# Altium schematic sheet USB_A & USB_C.SchDoc
size A3; DocumentNumber: 8; SheetNumber: 8; SheetTotal: 12
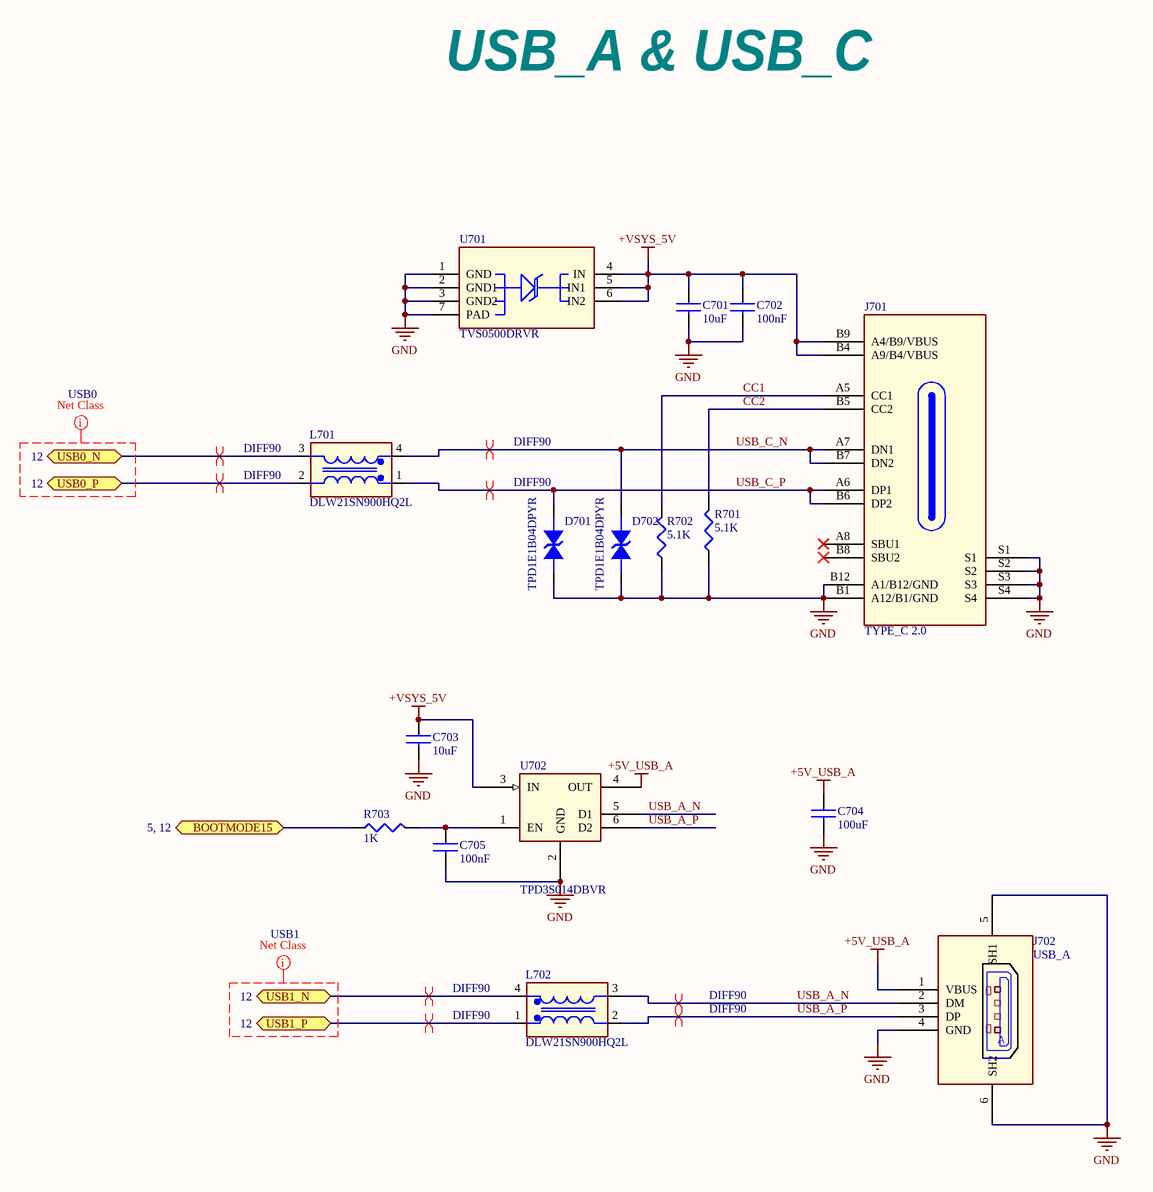
[diagram p0: USB_A & USB_C.SchDoc]

## Parts
C701  10uF  [C0603]
C702  100nF  [C0201]
C703  10uF  [C0603]
C704  100uF  [C1206B/3216MM]
C705  100nF  [C0201]
D701  TPD1E1B04DPYR  [DIO_TPD1E05U06DPYR]
D702  TPD1E1B04DPYR  [DIO_TPD1E05U06DPYR]
J701  TYPE_C 2.0  [GCT_USB4105-GF-A]
J702  USB_A  [GCT_USB1130-15-A_REVA]
L701  DLW21SN900HQ2L  [IND_DLW21S_0805_MUR]
L702  DLW21SN900HQ2L  [IND_DLW21S_0805_MUR]
R701  5.1K  [R0402]
R702  5.1K  [R0402]
R703  1K  [R0402]
U701  TVS0500DRVR  [wson6_0d65_2x2x0_8mm]
U702  TPD3S014DBVR  [SOT23-6]

## Ports
BOOTMODE15 (bidir, see 5, 12), USB0_N (bidir, see 12), USB0_P (bidir, see 12), USB1_N (bidir, see 12), USB1_P (bidir, see 12)

## Nets
+5V_USB_A: C704.1 J702.1(VBUS) U702.4(OUT)
+VSYS_5V: C701.1 C702.1 C703.1 J701.B4(A9/B4/VBUS) J701.B9(A4/B9/VBUS) U701.4(IN) U701.5(IN1) U701.6(IN2) U702.3(IN)
GND: C701.2 C702.2 C703.2 C704.2 C705.2 D701.1 D702.1 J701.B1(A12/B1/GND) J701.B12(A1/B12/GND) J701.S1 J701.S2 J701.S3 J701.S4 J702.4(GND) J702.5(SH1) J702.6(SH2) R701.1 R702.1 U701.1(GND) U701.2(GND1) U701.3(GND2) U701.7(PAD) U702.2(GND)
BOOTMODE15: R703.1 ; port BOOTMODE15
CC1: J701.A5(CC1) R702.2
CC2: J701.B5(CC2) R701.2
USB0_N: L701.3 ; port USB0_N
USB0_P: L701.2 ; port USB0_P
USB1_N: L702.4 ; port USB1_N
USB1_P: L702.1 ; port USB1_P
USB_A_N: J702.2(DM) L702.3 U702.5(D1)
USB_A_P: J702.3(DP) L702.2 U702.6(D2)
USB_C_N: D702.2 J701.A7(DN1) J701.B7(DN2) L701.4
USB_C_P: D701.2 J701.A6(DP1) J701.B6(DP2) L701.1
NetC705_1: C705.1 R703.2 U702.1(EN)

Not connected (* = marked no-connect by the designer): J701 A8(SBU1)* B8(SBU2)*

## Layout directives
differential pair; net class DIFF90: USB0_N, USB0_P, USB1_N, USB1_P, USB_A_N, USB_A_P, USB_C_N, USB_C_P
net class USB0: (no net found under the mark)
net class USB1: (no net found under the mark)

## Notes on the sheet
- USB_A & USB_C
- (in symbol USB1130-15-A) A

## Library data of the parts
C701 C703 = C1608X5R1A106K080AC: Multilayer Ceramic Capacitor, 10 uF, 10 V, ± 10%, X5R, 0603 [1608 Metric]; Manufacturer: TDK; Material: 4241ConductorMaterial; Voltage Rating (DC): 10V; Supplier 1: Arrow Electronics; Manufacturer Part Number: C1608X5R1A106K080AC; RoHS: Yes; Category: Ceramic Capacitors; Stock 1: 3399; Pricing 1: 1=0.263, 10=0.156, 25=0.1544, 50=0.1444, 100=0.1124, 250=0.1113, 500=0.1094, 1000=0.0748, 3000=0.0665 (USD); Mount: Surface Mount; Case/Package: 0603; Number of Pins: 2; Dielectric Material: Ceramic; Case Code (Imperial): 0603; Case Code (Metric): 1608; Weight: 7.1E-05oz; Min Operating Temperature: -55°C; Max Operating Temperature: 85°C; Capacitance: 10uF; Tolerance: 10%; Dielectric: X5R; Packaging: Tape and Reel; Voltage Rating: 10V; Package Quantity: 1; Termination: SMD/SMT; Voltage: 10V; Series: C; Construction: Flat; Length: 1.6mm; Width: 0.031inch; Height: 0.8mm; Depth: 0.8mm; Thickness: 0.035inch; Lead Free: Lead Free; Reach SVHC Compliant: No; RoHS Compliant: Yes; ComponentLink1URL: https://datasheet.ciiva.com/23802/1796654-23802763.pdf?src-supplier=Newark; ComponentLink1Description: https://datasheet.ciiva.com/23802/1796654-23802763.pdf?src-supplier=Newark; ComponentLink2URL: https://datasheet.ciiva.com/7975/1796654-7975065.pdf?src-supplier=Element14; ComponentLink2Description: https://datasheet.ciiva.com/7975/1796654-7975065.pdf?src-supplier=Element14; ComponentLink3URL: https://datasheet.ciiva.com/22694/1796654-22694118.pdf?src-supplier=Element14; ComponentLink3Description: https://datasheet.ciiva.com/22694/1796654-22694118.pdf?src-supplier=Element14; ComponentLink4URL: https://datasheet.ciiva.com/28577/mlcc-commercial-general-en-28577085.pdf?src-supplier=Element14; ComponentLink4Description: https://datasheet.ciiva.com/28577/mlcc-commercial-general-en-28577085.pdf?src-supplier=Element14; ComponentLink5URL: https://datasheet.ciiva.com/28577/1744655-28577071.pdf?src-supplier=Element14; ComponentLink5Description: https://datasheet.ciiva.com/28577/1744655-28577071.pdf?src-supplier=Element14; ComponentLink6URL: https://datasheet.ciiva.com/6288/tdkmlcccaprange-6288222.pdf?src-supplier=Digi-Key; ComponentLink6Description: https://datasheet.ciiva.com/6288/tdkmlcccaprange-6288222.pdf?src-supplier=Digi-Key; ComponentLink7URL: https://datasheet.ciiva.com/6288/tdkmlcccaprange-6288220.pdf?src-supplier=Digi-Key; ComponentLink7Description: https://datasheet.ciiva.com/6288/tdkmlcccaprange-6288220.pdf?src-supplier=Digi-Key; ComponentLink8URL: https://datasheet.ciiva.com/6288/tdkmlcccaprange-6288223.pdf?src-supplier=Digi-Key; ComponentLink8Description: https://datasheet.ciiva.com/6288/tdkmlcccaprange-6288223.pdf?src-supplier=Digi-Key; ComponentLink9URL: https://datasheet.ciiva.com/16449/mlcc-commercial-general-en-16449573.pdf?src-supplier=Future+Electronics; ComponentLink9Description: https://datasheet.ciiva.com/16449/mlcc-commercial-general-en-16449573.pdf?src-supplier=Future+Electronics; ComponentLink10URL: https://datasheet.ciiva.com/48671/e412-c-48671301.pdf?src-supplier=Avnet; ComponentLink10Description: https://datasheet.ciiva.com/48671/e412-c-48671301.pdf?src-supplier=Avnet; Supplier Part Number 1: C1608X5R1A106K080AC
C702 C705 = CC0201KRX5R6BB104: Multilayer Ceramic Capacitor, 0.1 uF, 16 V, ± 10%, X5R, 0201 [0603 Metric]; Manufacturer: Yageo; Material: 4241ConductorMaterial; Voltage Rating (DC): 10V; Supplier 1: Future Electronics; Manufacturer Part Number: CC0201KRX5R6BB104; RoHS: Yes; Category: Ceramic Capacitors; Stock 1: 10410000; Pricing 1: 15000=0.0027, 60000=0.0026, 150000=0.0025, 375000=0.0024, 600000=0.0023 (USD); Mount: Surface Mount; Case/Package: 0201; Case Code (Imperial): 0201; Case Code (Metric): 0603; Weight: 6E-06oz; Min Operating Temperature: -55°C; Max Operating Temperature: 85°C; Capacitance: 100nF; Tolerance: 10%; Dielectric: X5R; Packaging: Tape and Reel; Termination: SMD/SMT; Voltage Rating: 10V; Series: CC; Construction: Flat; Length: 0.6mm; Height: 0.3mm; Depth: 0.3mm; Radiation Hardening: No; RoHS Compliant: Yes; Halogen Free: 5694HalogenFree; Lead Free: 5697LeadFree; ComponentLink1URL: https://datasheet.ciiva.com/11587/upy-gphc-x5r-4v-to-50v-12-11587190.pdf?src-supplier=Avnet; ComponentLink1Description: https://datasheet.ciiva.com/11587/upy-gphc-x5r-4v-to-50v-12-11587190.pdf?src-supplier=Avnet; Supplier Part Number 1: 5050553
C704 = C3216X5R1A107M160AC: Multilayer Ceramic Capacitor, C Series, 100 - F, - 20%, X5R, 10 V, 1206 [3216 Metric]; Manufacturer: TDK; Material: 4241ConductorMaterial; Voltage Rating: 10V; Supplier 1: Arrow Electronics; Manufacturer Part Number: C3216X5R1A107M160AC; RoHS: Yes; Category: Ceramic Capacitors; Stock 1: 18000; Pricing 1: 2000=0.4841 (USD); Mount: Surface Mount; Case/Package: 1206; Case Code (Imperial): 1206; Case Code (Metric): 3216; Weight: 0.000571oz; Dielectric Material: Ceramic; Min Operating Temperature: -55°C; Max Operating Temperature: 85°C; Capacitance: 100uF; Tolerance: 20%; Voltage Rating (DC): 10V; Packaging: Tape and Reel; Package Quantity: 1; Dielectric: X5R; Termination: SMD/SMT; Voltage: 10V; Series: C; Construction: Flat; Length: 3.2mm; Width: 0.063inch; Height: 1.6mm; Thickness: 0.075inch; Depth: 1.6mm; Reach SVHC Compliant: No; Lead Free: Lead Free; RoHS Compliant: Yes; ComponentLink1URL: https://datasheet.ciiva.com/24216/c3216x5r1a107m160ac-265050-24216592.pdf?src-supplier=Mouser; ComponentLink1Description: https://datasheet.ciiva.com/24216/c3216x5r1a107m160ac-265050-24216592.pdf?src-supplier=Mouser; ComponentLink2URL: https://datasheet.ciiva.com/7975/1796654-7975125.pdf?src-supplier=Element14; ComponentLink2Description: https://datasheet.ciiva.com/7975/1796654-7975125.pdf?src-supplier=Element14; ComponentLink3URL: https://datasheet.ciiva.com/22694/1796654-22694157.pdf?src-supplier=Element14; ComponentLink3Description: https://datasheet.ciiva.com/22694/1796654-22694157.pdf?src-supplier=Element14; ComponentLink4URL: https://datasheet.ciiva.com/22725/1913358-22725579.pdf?src-supplier=Element14; ComponentLink4Description: https://datasheet.ciiva.com/22725/1913358-22725579.pdf?src-supplier=Element14; ComponentLink5URL: https://datasheet.ciiva.com/28620/mlcc-commercial-general-en-28620362.pdf?src-supplier=Element14; ComponentLink5Description: https://datasheet.ciiva.com/28620/mlcc-commercial-general-en-28620362.pdf?src-supplier=Element14; ComponentLink6URL: https://datasheet.ciiva.com/6284/tdkmlcccaprange-6284586.pdf?src-supplier=Digi-Key; ComponentLink6Description: https://datasheet.ciiva.com/6284/tdkmlcccaprange-6284586.pdf?src-supplier=Digi-Key; ComponentLink7URL: https://datasheet.ciiva.com/6284/tdkmlcccaprange-6284584.pdf?src-supplier=Digi-Key; ComponentLink7Description: https://datasheet.ciiva.com/6284/tdkmlcccaprange-6284584.pdf?src-supplier=Digi-Key; ComponentLink8URL: https://datasheet.ciiva.com/6284/tdkmlcccaprange-6284588.pdf?src-supplier=Digi-Key; ComponentLink8Description: https://datasheet.ciiva.com/6284/tdkmlcccaprange-6284588.pdf?src-supplier=Digi-Key; ComponentLink9URL: https://datasheet.ciiva.com/16482/e412-c-16482549.pdf?src-supplier=Future+Electronics; ComponentLink9Description: https://datasheet.ciiva.com/16482/e412-c-16482549.pdf?src-supplier=Future+Electronics; ComponentLink10URL: https://datasheet.ciiva.com/48671/e412-c-48671366.pdf?src-supplier=Avnet; ComponentLink10Description: https://datasheet.ciiva.com/48671/e412-c-48671366.pdf?src-supplier=Avnet; Supplier Part Number 1: C3216X5R1A107M160AC
D701 D702 = TPD1E1B04DPYR: 1-pF, ±3.6-V, ±30-kV ESD protection diode with 6-A 8/20-uS surge & Low Clamping in 0402 package; Manufacturer: Texas Instruments; Capacitance: 1pF; Interface: LVDS,USB,Ethernet; Number of Channels: 1; Direction: 211Direction; Breakdown Voltage: 6.4V; Clamping Voltage: 8.5V; Peak Pulse Current: 6.3A; Peak Pulse Power: 50W; Reverse Standoff Voltage: 3.6V; Supplier 1: Mouser; Manufacturer Part Number: TPD1E1B04DPYR; RoHS: Yes; Category: Integrated Circuits (ICs); Stock 1: 57724; Pricing 1: 1=0.35, 10=0.28, 50=0.28, 100=0.184, 500=0.144, 1000=0.102, 2500=0.098, 10000=0.085, 20000=0.084, 50000=0.079 (USD); Number of Pins: 2NUMBER; Min Operating Temperature: -40°C; Max Operating Temperature: 125°C; Length: 600um; Width: 1mm; Height: 450um; Thickness: 370um; Lead Free: Lead Free; RoHS Compliant: Yes; ComponentLink1URL: http://www.ti.com/lit/ds/symlink/tpd1e1b04.pdf?src-supplier=Digi-Key; ComponentLink1Description: http://www.ti.com/lit/ds/symlink/tpd1e1b04.pdf?src-supplier=Digi-Key; ComponentLink2URL: http://www.ti.com/general/docs/suppproductinfo.tsp?distId=10&amp;gotoUrl=http%3A%2F%2Fwww.ti.com%2Flit%2Fgpn%2Ftpd1e1b04&src-supplier=Digi-Key; ComponentLink2Description: http://www.ti.com/general/docs/suppproductinfo.tsp?distId=10&amp;gotoUrl=http%3A%2F%2Fwww.ti.com%2Flit%2Fgpn%2Ftpd1e1b04&src-supplier=Digi-Key; Supplier Part Number 1: 595-TPD1E1B04DPYR
J701 = USB4105-GF-A: Conn USB 2.0 Type C RCP 24 POS 0.3mm/0.5mm Solder RA SMD 24 Terminal 1 Port T/R; Manufacturer: Global Connector Technology; USB Standard: 6108USBStandard; Number of Contacts: 16NUMBER; Voltage Rating: 20V; Gender: Receptacle; Mating Cycles: 10000; Shielding: Shielded; Number of Ports: 1; Supplier 1: Newark; Manufacturer Part Number: USB4105-GF-A; RoHS: No; Category: USB Connectors; Stock 1: 1576; Pricing 1: 1=0.811, 10=0.737, 25=0.695, 50=0.666, 100=0.638, 250=0.581, 500=0.539 (USD); Mount: Surface Mount,Through Hole,Horizontal; Contact Material: 153,157ConductorMaterial; Contact Plating: Gold; Insulation Color: Black; Min Operating Temperature: -40°C; Max Operating Temperature: 85°C; Connector Type: USB; Series: USB4105; Termination: Solder; Height: 3.46mm; Flammability Rating: UL94 V-0; ComponentLink1URL: https://gct.co/files/drawings/usb4105.pdf?src-supplier=Digi-Key; ComponentLink1Description: https://gct.co/files/drawings/usb4105.pdf?src-supplier=Digi-Key; ComponentLink2URL: https://datasheet.octopart.com/USB4105-GF-A-GCT-datasheet-166929323.pdf?src-supplier=TME; ComponentLink2Description: https://datasheet.octopart.com/USB4105-GF-A-GCT-datasheet-166929323.pdf?src-supplier=TME; Supplier Part Number 1: 86AH2021
J702 = USB1130-15-A: Usb Conn, 2.0 Type A, R/a Rcpt, 4Pos, Th Rohs Compliant: Yes; Manufacturer: Global Connector Technology; Supplier 1: Future Electronics; Manufacturer Part Number: USB1130-15-A; RoHS: No; Category: Connectors; Stock 1: 460; Pricing 1: 230=0.425, 690=0.41, 1150=0.4, 2300=0.39, 4600=0.375 (USD); ComponentLink1URL: https://datasheet.octopart.com/USB1130-15-A-Global-Connector-Technology-datasheet-148834151.pdf?src-supplier=Future+Electronics; ComponentLink1Description: https://datasheet.octopart.com/USB1130-15-A-Global-Connector-Technology-datasheet-148834151.pdf?src-supplier=Future+Electronics; Supplier Part Number 1: 5161878
L701 L702 = DLW21SN900HQ2L: Ind Common Mode Choke Wirewound 90Ohm 25% 100MHz 280mA 0805 Embossed T/R; Manufacturer: Murata; Impedance: 90R; Number of Lines: 2; Shielding: Unshielded; DC Resistance (DCR): 410mR; Voltage Rating (DC): 20V; Supplier 1: Arrow Electronics; Manufacturer Part Number: DLW21SN900HQ2L; RoHS: Yes; Category: Common Mode Chokes; Stock 1: 18000; Pricing 1: 2000=0.2295, 4000=0.2273, 6000=0.225, 10000=0.2175, 24000=0.2153, 50000=0.2148 (USD); Mount: Surface Mount; Case/Package: 0805; Weight: 0.000388oz; Case Code (Imperial): 0805; Min Operating Temperature: -40°C; Max Operating Temperature: 85°C; Tolerance: 25%; Package Quantity: 1; Packaging: Tape and Reel; Current Rating: 280mA; Current: 280mA; Max DC Current: 280mA; Termination: SMD/SMT; Test Frequency: 100MHz; DC Current: 280mA; Series: EMIFIL®, DLW21S; Max Current Rating: 280mA; Length: 2mm; Width: 0.047inch; Height: 0.055inch; Depth: 1.2mm; Radiation Hardening: No; Military Standard: Not; Reach SVHC Compliant: No; Lead Free: Lead Free; RoHS Compliant: Yes; ComponentLink1URL: https://datasheet.ciiva.com/3068/l0114s0133dlw21s-3068656.pdf?src-supplier=Avnet; ComponentLink1Description: https://datasheet.ciiva.com/3068/l0114s0133dlw21s-3068656.pdf?src-supplier=Avnet; ComponentLink2URL: https://datasheet.ciiva.com/6216/l0114e-6216255.pdf?src-supplier=Digi-Key; ComponentLink2Description: https://datasheet.ciiva.com/6216/l0114e-6216255.pdf?src-supplier=Digi-Key; ComponentLink3URL: https://datasheet.ciiva.com/4952/muratadl-plseries-202927-4952310.pdf?src-supplier=Mouser; ComponentLink3Description: https://datasheet.ciiva.com/4952/muratadl-plseries-202927-4952310.pdf?src-supplier=Mouser; ComponentLink4URL: https://datasheet.ciiva.com/18183/getdatasheetpartid-228875-18183367.pdf?src-supplier=Verical; ComponentLink4Description: https://datasheet.ciiva.com/18183/getdatasheetpartid-228875-18183367.pdf?src-supplier=Verical; Supplier Part Number 1: DLW21SN900HQ2L
R701 R702 = AC0402FR-075K1L: SMD Chip Resistor, 5.1 kOhm, ± 1%, 63 mW, 0402 [1005 Metric], Thick Film, General Purpose; Manufacturer: Yageo; Resistance: 5.1kR; Power Rating: 63mW; Temperature Coefficient: 100ppm/°C; Voltage Rating: 50V; Supplier 1: Future Electronics; Manufacturer Part Number: AC0402FR-075K1L; RoHS: Yes; Category: Chip SMD Resistors; Stock 1: 10000; Pricing 1: 10000=0.0011, 50000=0.001, 200000=0.0009, 500000=0.0009, 1250000=0.0008 (USD); Mount: Surface Mount; Case/Package: 0402; Case Code (Metric): 1005; Case Code (Imperial): 0402; Size Code: 0402; Min Operating Temperature: -55°C; Max Operating Temperature: 155°C; Tolerance: 1%; Packaging: Cut Tape; Number of Terminations: 2; Max Power Dissipation: 63mW; Features: Moisture Resistant,Automotive AEC-Q200; Series: AC; Length: 0.039inch; Width: 0.02inch; Height: 0.015inch; RoHS Compliant: Yes; Lead Free: 5697LeadFree; ComponentLink1URL: https://datasheet.octopart.com/AC0402FR-075K1L-Yageo-datasheet-166720450.pdf?src-supplier=Future+Electronics; ComponentLink1Description: https://datasheet.octopart.com/AC0402FR-075K1L-Yageo-datasheet-166720450.pdf?src-supplier=Future+Electronics; ComponentLink2URL: http://www.yageo.com/documents/recent/PYu-AC_51_RoHS_L_2_revised.pdf?src-supplier=Future+Electronics; ComponentLink2Description: http://www.yageo.com/documents/recent/PYu-AC_51_RoHS_L_2_revised.pdf?src-supplier=Future+Electronics; Supplier Part Number 1: 8112408
R703 = RC0402FR-071KL: SMD Chip Resistor, 1 kOhm, ± 1%, 63 mW, 0402 [1005 Metric], Thick Film, General Purpose; Manufacturer: Yageo; Resistance: 1kR; Temperature Coefficient: 100ppm/°C; Voltage Rating (DC): 50V; Power Rating: 62.5mW; Max Power Dissipation: 63mW; Supplier 1: Future Electronics; Manufacturer Part Number: RC0402FR-071KL; RoHS: Yes; Category: Chip SMD Resistors; Stock 1: 37960000; Pricing 1: 10000=0.0008, 50000=0.0008, 250000=0.0007, 500000=0.0007, 1500000=0.0007 (USD); Case/Package: 0402; Number of Pins: 2; Case Code (Imperial): 0402; Case Code (Metric): 1005; Size Code: 0402; Min Operating Temperature: -55°C; Max Operating Temperature: 155°C; Resistor Type: Thick Film; Tolerance: 1%; Packaging: Tape and Reel; Voltage Rating: 50V; Termination: SMD/SMT; Features: Moisture Resistant; Series: RC; Number of Terminations: 2; Resistance Tolerance: 1%; Construction: Rectangular; Technology: THICK FILM; Voltage Rating (AC): 50V; Length: 1mm; Width: 0.5mm; Height: 0.32mm; Depth: 0.5mm; Reach SVHC Compliant: No; RoHS Compliant: Yes; Military Standard: Not; ComponentLink1URL: https://datasheet.ciiva.com/11819/0900766b80c66297-11819477.pdf?src-supplier=Rs; ComponentLink1Description: https://datasheet.ciiva.com/11819/0900766b80c66297-11819477.pdf?src-supplier=Rs; ComponentLink2URL: https://datasheet.ciiva.com/7983/1018594-7983502.pdf?src-supplier=Element14; ComponentLink2Description: https://datasheet.ciiva.com/7983/1018594-7983502.pdf?src-supplier=Element14; ComponentLink3URL: https://datasheet.ciiva.com/22747/1018594-22747513.pdf?src-supplier=Element14; ComponentLink3Description: https://datasheet.ciiva.com/22747/1018594-22747513.pdf?src-supplier=Element14; ComponentLink4URL: https://datasheet.ciiva.com/12666/pyu-rc0402-51-rohs-l-6-r-12666741.pdf?src-supplier=Mouser; ComponentLink4Description: https://datasheet.ciiva.com/12666/pyu-rc0402-51-rohs-l-6-r-12666741.pdf?src-supplier=Mouser; ComponentLink5URL: https://datasheet.ciiva.com/7849/1018594-7849869.pdf?src-supplier=Element14; ComponentLink5Description: https://datasheet.ciiva.com/7849/1018594-7849869.pdf?src-supplier=Element14; ComponentLink6URL: https://datasheet.ciiva.com/7849/1018594-7849871.pdf?src-supplier=Element14; ComponentLink6Description: https://datasheet.ciiva.com/7849/1018594-7849871.pdf?src-supplier=Element14; ComponentLink7URL: https://datasheet.ciiva.com/17063/pyu-rc0402-51-rohs-l-6-r-17063193.pdf?src-supplier=Future+Electronics; ComponentLink7Description: https://datasheet.ciiva.com/17063/pyu-rc0402-51-rohs-l-6-r-17063193.pdf?src-supplier=Future+Electronics; Supplier Part Number 1: 7825607
U701 = TVS0500DRVR: Diode TVS Single Uni-Dir 5V 400W 6-Pin WSON EP T/R; Manufacturer: Texas Instruments; Number of Channels: 1; Min Breakdown Voltage: 7.5V; Peak Pulse Current: 43A; Power Line Protection: No; Diode Type: ZENER; Supplier 1: Mouser; Manufacturer Part Number: TVS0500DRVR; RoHS: Yes; Category: TVS Diodes; Stock 1: 8389; Pricing 1: 1=0.62, 10=0.533, 50=0.533, 100=0.371, 500=0.29, 1000=0.235, 3000=0.195, 9000=0.19, 10000=0.19, 24000=0.18 (USD); Mount: Surface Mount; Min Operating Temperature: -40°C; Max Operating Temperature: 125°C; Packaging: Cut Tape; Number of Unidirectional Channels: 1; Reverse Standoff Voltage: 5V; Peak Pulse Power: 400W; Series: -; RoHS Compliant: Yes; ComponentLink1URL: http://www.ti.com/lit/ds/symlink/tvs0500.pdf?src-supplier=Digi-Key; ComponentLink1Description: http://www.ti.com/lit/ds/symlink/tvs0500.pdf?src-supplier=Digi-Key; ComponentLink2URL: http://www.ti.com/lit/ds/symlink/tvs0500.pdf?src-supplier=Farnell; ComponentLink2Description: http://www.ti.com/lit/ds/symlink/tvs0500.pdf?src-supplier=Farnell; Supplier Part Number 1: 595-TVS0500DRVR
U702 = TPD3S014DBVR: Current-limit switch and D+/D– ESD protection for USB Host ports 6-SOT-23 -40 to 85; Manufacturer: Texas Instruments; Supplier 1: Mouser; Manufacturer Part Number: TPD3S014DBVR; RoHS: Yes; Category: Integrated Circuits (ICs); Stock 1: 21420; Pricing 1: 1=1.13, 10=0.924, 50=0.924, 100=0.719, 1000=0.497, 10000=0.424 (USD); ComponentLink1URL: http://www.ti.com/lit/gpn/tpd3s014?src-supplier=Mouser; ComponentLink1Description: http://www.ti.com/lit/gpn/tpd3s014?src-supplier=Mouser; ComponentLink2URL: http://www.ti.com/general/docs/lit/getliterature.tsp?genericPartNumber=TPD3S014&&fileType=pdf&src-supplier=Element14; ComponentLink2Description: http://www.ti.com/general/docs/lit/getliterature.tsp?genericPartNumber=TPD3S014&&fileType=pdf&src-supplier=Element14; ComponentLink3URL: http://www.ti.com/lit/ds/symlink/tpd3s014.pdf?src-supplier=Digi-Key; ComponentLink3Description: http://www.ti.com/lit/ds/symlink/tpd3s014.pdf?src-supplier=Digi-Key; ComponentLink4URL: http://www.ti.com/general/docs/lit/getliterature.tsp?genericPartNumber=TPD3S044&&fileType=pdf&src-supplier=Avnet; ComponentLink4Description: http://www.ti.com/general/docs/lit/getliterature.tsp?genericPartNumber=TPD3S044&&fileType=pdf&src-supplier=Avnet; ComponentLink5URL: http://www.ti.com/general/docs/lit/getliterature.tsp?genericPartNumber=TPD3S014&&fileType=pdf&src-supplier=Farnell; ComponentLink5Description: http://www.ti.com/general/docs/lit/getliterature.tsp?genericPartNumber=TPD3S014&&fileType=pdf&src-supplier=Farnell; Supplier Part Number 1: 595-TPD3S014DBVR